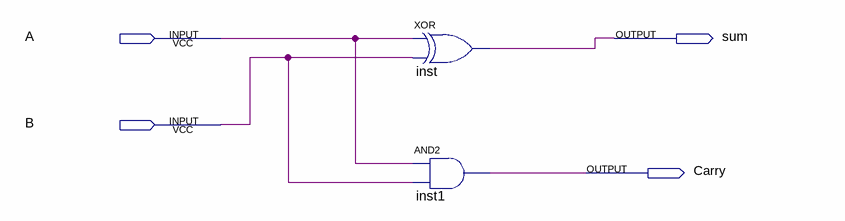
[diagram p0: schematic sheet]
// Quartus schematic halfadder.bdf as structural Verilog: 2 symbols, 4 pins
module halfadder (
  input  A,
  input  B,
  output sum,
  output Carry
);

  xor inst (sum, A, B);
  and inst1 (Carry, A, B);
endmodule
